# EAGLE design magnetic-rotary-encoder (EAGLE 5.08)
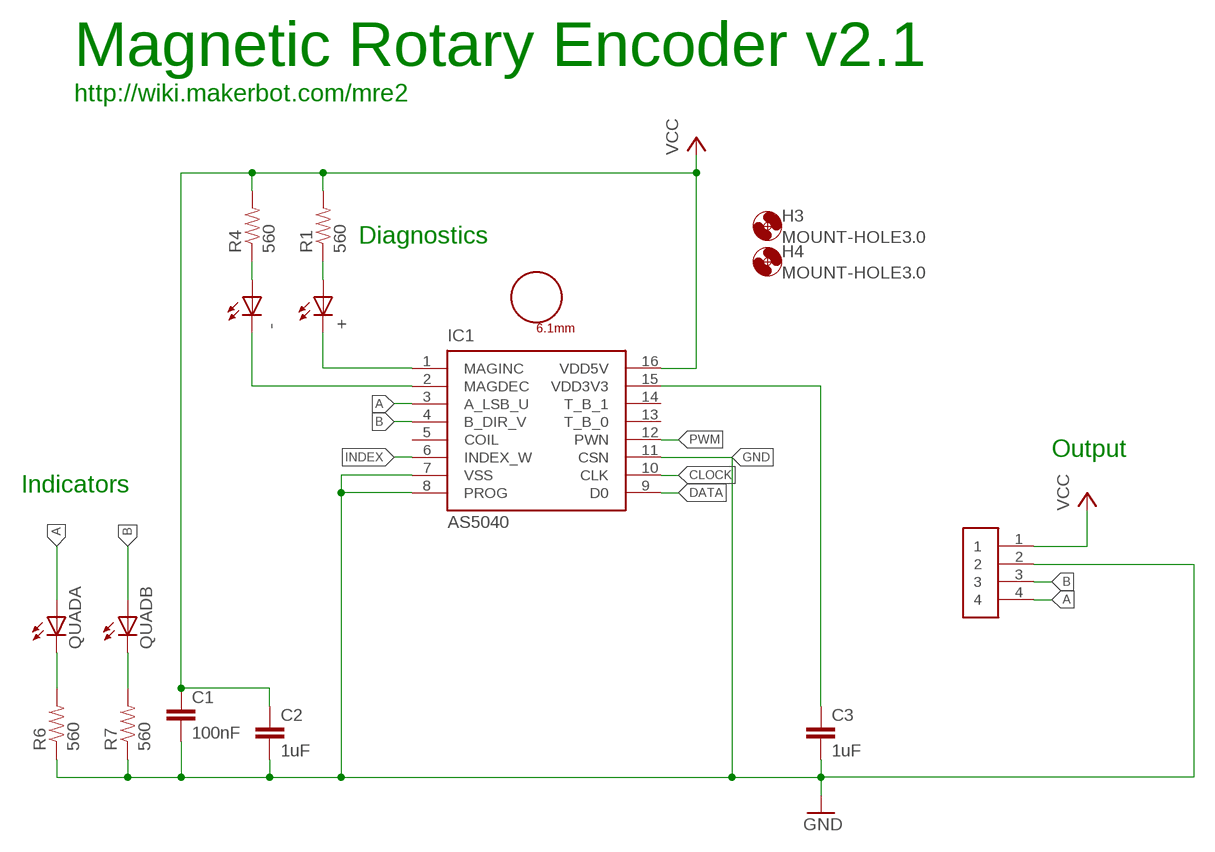
[diagram p0: schematic, sheet 1]

## Parts
+  LED0805  [LED-0805]
-  LED0805  [LED-0805]
C1  100nF  CAP0805  [0805]
C2  1uF  CAP0805  [0805]
C3  1uF  CAP0805  [0805]
H3  MOUNT-HOLE3.0  [3,0]
H4  MOUNT-HOLE3.0  [3,0]
IC1  AS5040  [SSOP16]
QUADA  LED0805  [LED-0805]
QUADB  LED0805  [LED-0805]
R1  560  RESISTOR  [0805]
R4  560  RESISTOR  [0805]
R6  560  RESISTOR  [0805]
R7  560  RESISTOR  [0805]
U$1  6.1MMHOLE  [6.1MMHOLE]
U$2  CDROM  [70553-04]

## Nets
A: IC1.3(A_LSB_U) QUADA.A U$2.4
B: IC1.4(B_DIR_V) QUADB.A U$2.3
CLOCK: IC1.10(CLK)
DATA: IC1.9(D0)
GND: C1.2 C2.2 C3.2 IC1.7(VSS) IC1.8(PROG) IC1.11(CSN) R6.1 R7.1 U$2.2
INDEX: IC1.6(INDEX_W)
N$7: +.C IC1.1(MAGINC)
N$8: C3.1 IC1.15(VDD3V3)
N$10: -.C IC1.2(MAGDEC)
N$11: +.A R1.1
N$12: -.A R4.1
N$13: QUADA.C R6.2
N$14: QUADB.C R7.2
PWM: IC1.12(PWN)
VCC: C1.1 C2.1 IC1.16(VDD5V) R1.2 R4.2 U$2.1
Unconnected: IC1.5(COIL) IC1.13(T_B_0) IC1.14(T_B_1)

## Notes on the sheet
- Magnetic Rotary Encoder v2.1
- http://wiki.makerbot.com/mre2
- Diagnostics
- Output
- Indicators

## Library data of the parts
+ - QUADA QUADB = SparkFun:LED: LEDs Standard schematic elements and footprints for 5mm, 3mm, 1206, and 0603 sized LEDs. 5mm - Spark Fun Electronics SKU : COM-00529 (and others)
C1-C3 = SparkFun:CAP: Capacitor Standard 0603 ceramic capacitor, and 0.1" leaded capacitor.
H3 H4 = holes:MOUNT-HOLE: MOUNTING HOLE with drill center marker
IC1 = austriamicrosystems:AS5040: 10-BIT PROGRAMMABLE MAGNETIC ROTARY ENCODER Source: www.austriamicrosystems.com .. AS5040DataSheetRev12.pdf
R1 R4 R6 R7 = SparkFun:RESISTOR: Resistor Basic schematic elements and footprints for 0603, 1206, and PTH 1/10th watt (small) resistors.
U$1 = reprap:6.1MMHOLE
U$2 = reprap:CDROM

## Board
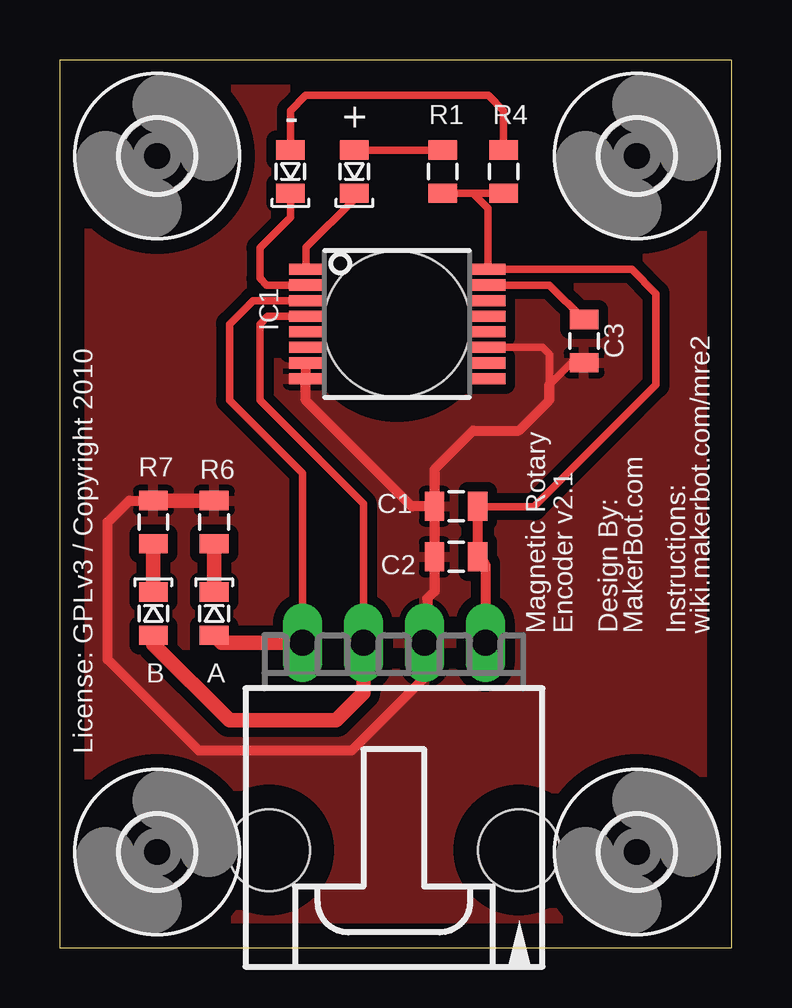
[diagram p1: board, top side]
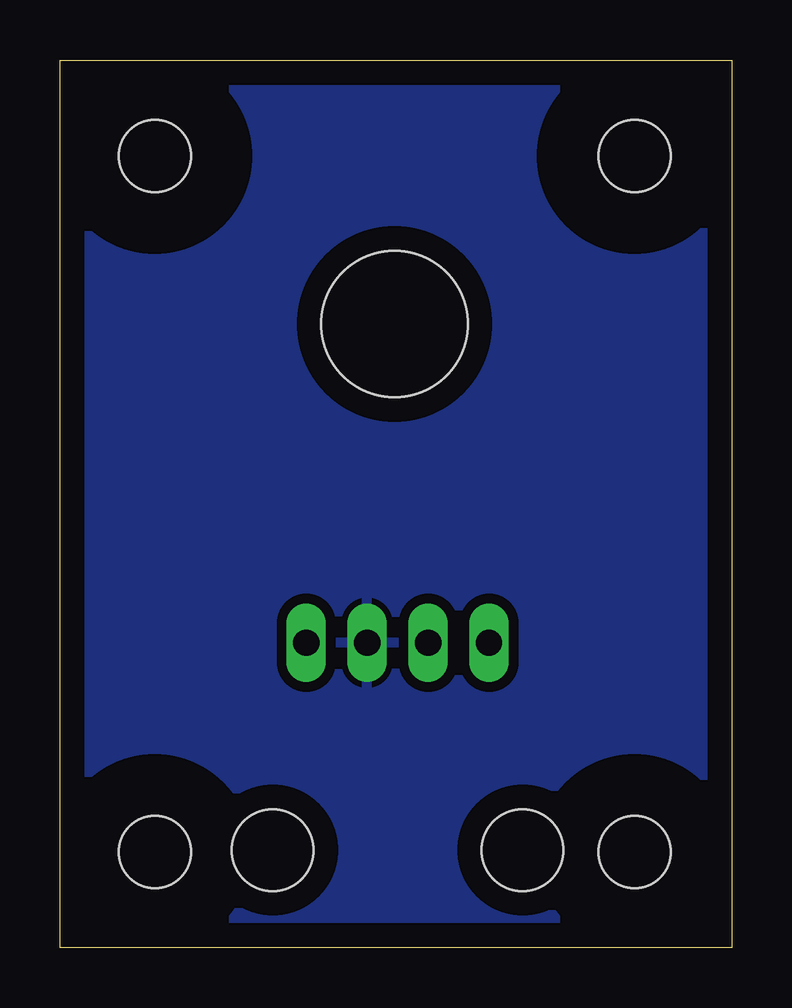
[diagram p2: board, bottom side, seen from below]

Size 28 x 36.98 mm. Coordinates in mm from the lower left corner, seen from the top.
Outline: 0,0 28,0 28,36.98 0,36.98 0,0
Copper layers (1*16): Top 0.035mm / dielectric 1.5mm / Bottom 0.035mm
Design rules "default": minimum track width 10mil, minimum drill 24mil, track to track 16mil, track to pad 16mil, pad to pad 16mil, via to via 16mil, smd to smd 8mil, copper to edge 40mil, drill to drill 8mil, minimum pad ring 10mil, minimum via ring 8mil, stop-mask expansion 4mil, vias tented up to drill 0mil, thermal gap 10mil

### Footprints (pad centres in the part's own frame; a part is rotated, then mirrored left to right if it is on the bottom)
LED-0805 = smd 1.2 x 0.8: A 0,-0.9; C 0,0.9
0805 = smd 0.8 x 1.2: 1 -0.9,0; 2 0.9,0
3,0 = hole 3: 0,0
SSOP16 = smd 0.46 x 1.43: 1 -2.275,-3.795; 2 -1.625,-3.795; 3 -0.975,-3.795; 4 -0.325,-3.795; 5 0.325,-3.795; 6 0.975,-3.795; 7 1.625,-3.795; 8 2.275,-3.795; 9 2.275,3.795; 10 1.625,3.795; 11 0.975,3.795; 12 0.325,3.795; 13 -0.325,3.795; 14 -0.975,3.795; 15 -1.625,3.795; 16 -2.275,3.795
6.1MMHOLE = hole 6.098: 0,0
70553-04 = drill 1.092 long: 1 -3.81,-7.62; 2 -1.27,-7.62; 3 1.27,-7.62; 4 3.81,-7.62 | hole 3.4: 5.207,1.016; -5.207,1.016

### Placement (x,y rotation side)
+  12.27,32.33 180 top
-  9.61,32.33 180 top
C1  16.52,18.39 180 top
C2  16.52,16.28 180 top
C3  21.85,25.27 270 top
H1  MOUNT-HOLE3.0  [3,0]  24.05,32.98 0 top
H2  MOUNT-HOLE3.0  [3,0]  24.05,3.98 0 top
H3  4.05,3.98 0 top
H4  4.05,32.98 0 top
IC1  14.05,25.98 270 top
QUADA  6.43,13.92 0 top
QUADB  3.89,13.92 0 top
R1  15.96,32.33 270 top
R4  18.5,32.33 270 top
R6  6.43,17.73 270 top
R7  3.89,17.73 270 top
U$1  14.05,25.98 0 top
U$2  13.92,5.08 180 top

### Tracks (layer width: path | path; a pad name or v marks a point on that pad's centre or on a via)
A
  Top 0.305: U$2.4 10.11,19.76 7.07,22.81 7.07,25.98 8.04,26.96 IC1.3
  Top 0.61: U$2.4 6.75,12.7 QUADA.A
B
  Top 0.305: U$2.3 12.65,18.49 8.34,22.81 8.34,25.98 8.66,26.31 IC1.4
  Top 0.61: QUADB.A 3.89,12.65 7.07,9.47 11.51,9.47 12.65,10.62 U$2.3
GND
  Top 0.305: IC1.11 20.11,25.01 20.4,24.71 20.4,23.44 21.33,24.37 C3.2
  Top 0.406: R7.1 2.89,18.63 1.99,17.73 1.99,12.01 5.8,8.2 12.15,8.2 15.19,11.25 U$2.2 15.32,12.83 15.32,14.55 15.62,14.85 C2.2 C1.2 | IC1.7 IC1.8 10.24,23.69 10.24,22.81 14.66,18.39 C1.2 | C1.2 15.62,19.93 17.23,21.54 19.13,21.54 20.4,22.81 20.4,23.44
  Top 0.61: R7.1 R6.1
  pour Bottom: -0.55,37.41 28.66,37.41 28.66,-0.69 -0.55,-0.69
  pour Top: -0.55,37.41 28.66,37.41 28.66,-0.69 -0.55,-0.69
N$7
  Top 0.254: 12.27,31.19 +.C
  Top 0.305: IC1.1 10.26,29.17 12.27,31.19
N$8
  Top 0.305: IC1.15 20.41,27.61 C3.1
N$10
  Top 0.305: IC1.2 8.62,27.61 8.34,27.89 8.34,29.16 9.61,30.43 -.C
N$11
  Top 0.305: R1.1 +.A
N$12
  Top 0.305: -.A 9.61,34.87 10.24,35.51 17.86,35.51 18.5,34.87 R4.1
N$13
  Top 0.61: R6.2 QUADA.C
N$14
  Top 0.61: R7.2 QUADB.C
VCC
  Top 0.305: 17.23,31.43 R1.2 | 17.23,31.43 R4.2 | 17.23,31.43 17.85,30.81 IC1.16 23.84,28.26 24.85,27.25 24.85,23.44 19.77,18.36 17.44,18.36
  Top 0.406: U$2.1 17.73,15.96 C2.1 C1.1 17.44,18.36

### Text on the board
tPlace: Magnetic Rotary | Encoder v2.1 | Design By: | MakerBot.com | Instructions: | wiki.makerbot.com/mre2 | B | A | License: GPLv3 / Copyright 2010